# Altium project Power2.PrjPcb
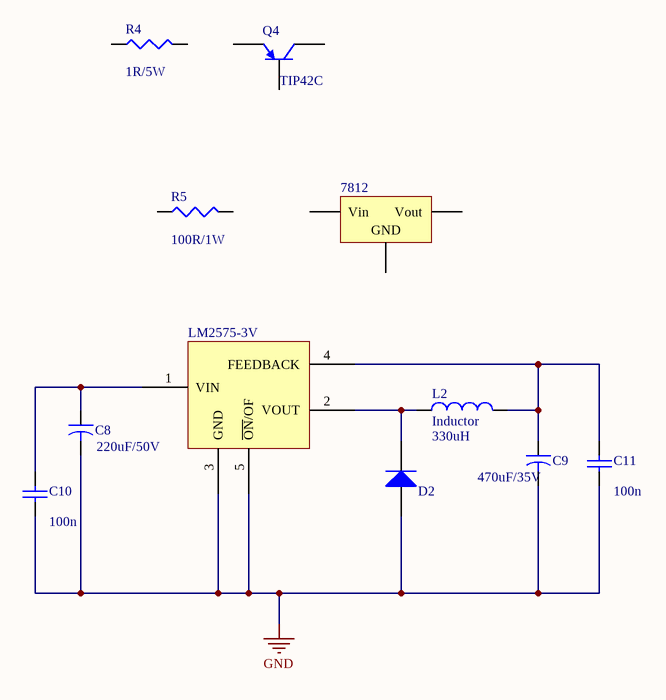
[diagram p0: power2.SchDoc]
1 sheet, 11 parts. Net scope: global (net labels, ports and power ports of the same name join across sheets).

## Sheet power2.SchDoc
size A

### Parts
7812  Volt Reg  [78xx_NO]  (value not drawn)
C8  value 220uF/50V  [TU 220uF/50V]  (hidden comment: Cap2)
C9  value 470uF/35V  [TU 470uF/50V]  (hidden comment: Cap2)
C10  value 100n  [tu_gom]  (hidden comment: Cap Semi)
C11  value 100n  [tu_gom]  (hidden comment: Cap Semi)
D2  Diode  [D_1A]  (value not drawn)
L2  Inductor  value 330uH  [R_Nor]
LM2575-3V  LM2575-xx  [LM2575_3]  (value not drawn)
Q4  TIP42C  [TIP42C]
R4  value 1R/5W  [R_CS1R/5W]  (hidden comment: Res3)
R5  value 100R/1W  [R_Nor]  (hidden comment: Res3)

### Nets
GND: C8.2 C9.2 C10.1 C11.1 D2.1(A) LM2575-3V.3(GND) LM2575-3V.5(~{ON}/OF)
NetC8_1: C8.1 C10.2 LM2575-3V.1(VIN)
NetC9_1: C9.1 C11.2 L2.2 LM2575-3V.4(FEEDBACK)
NetD2_2: D2.2(K) L2.1 LM2575-3V.2(VOUT)

Not connected (* = marked no-connect by the designer): 7812 1(Vin) 2(GND) 3(Vout); Q4 1(B) 2(C) 3(E); R4 1 2; R5 1 2

### Library data of the parts
7812 = Volt Reg: Voltage Regulator; Published: 24-Mar-1999; LatestRevisionDate: 17-Jul-2002; LatestRevisionNote: Re-released for DXP Platform.; PackageReference: D2PAK; Publisher: Altium Limited; Code_JEDEC: SMD-220
C8 C9 = Cap2: Capacitor; Published: 23-Sep-2002; PackageReference: CAPR5-4X5; Publisher: Altium Limited
C10 C11 = Cap Semi: Capacitor (Semiconductor SIM Model); Published: 8-Jun-2000; LatestRevisionDate: 17-Jul-2002; LatestRevisionNote: Re-released for DXP Platform.; PackageReference: C1206; Publisher: Altium Limited
L2 = Inductor: Code_IEC: 1005; Published: 8-Jun-2000; LatestRevisionDate: 17-Jul-2002; LatestRevisionNote: Re-released for DXP Platform.; PackageReference: 0402-A; Publisher: Altium Limited; Code_JEITA: 0402
LM2575-3V = LM2575-3V
Q4 = PNP: PNP Bipolar Transistor; Published: 8-Jun-2000; LatestRevisionDate: 17-Jul-2002; LatestRevisionNote: Re-released for DXP Platform.; PackageReference: SOT-23B; Publisher: Altium Limited; Code_JEDEC: SOT-23
R4 R5 = Res3: Resistor; Published: 8-Jun-2000; LatestRevisionDate: 04-Mar-2005; LatestRevisionNote: PCB Footprint replaced.; PackageReference: J1-0603; Publisher: Altium Limited